# EAGLE schematic mrna_badge (EAGLE 9.7.0)
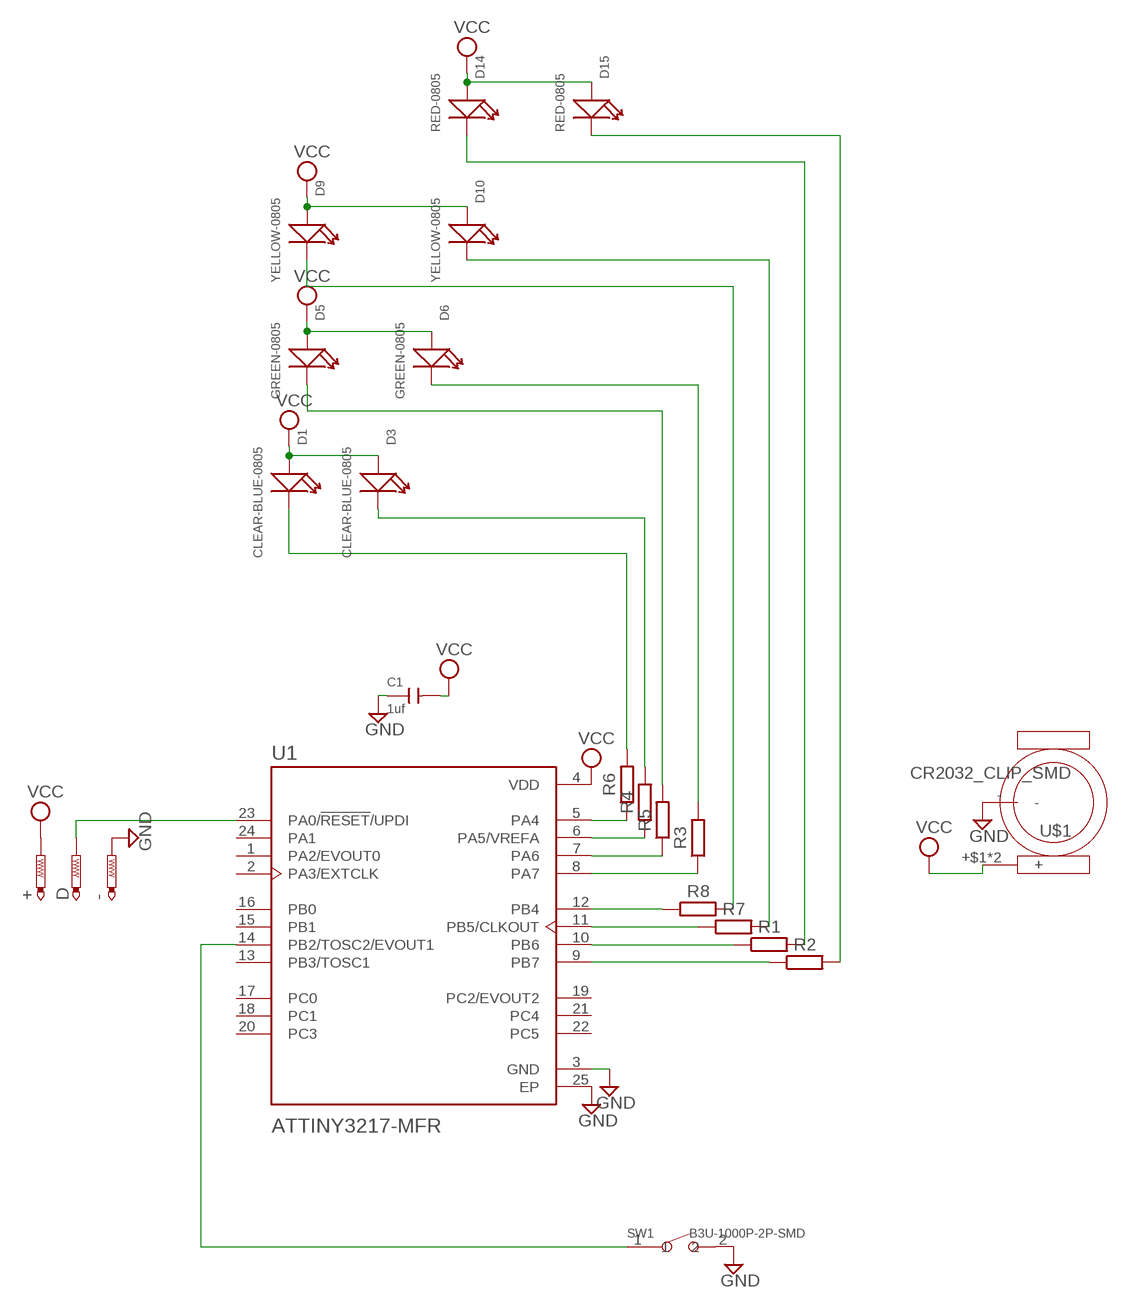
[diagram p0: schematic, sheet 1]

## Parts
+  PTR1TP15R  [TP15R]
-  PTR1TP15R  [TP15R]
C1  1uf  CERAMIC-1UF-25V-10%-X7R(0805)  [C0805]
D  PTR1TP15R  [TP15R]
D1  CLEAR-BLUE-0805  SMD-LED-CLEAR-BLUE(0805)  [LED-0805]
D3  CLEAR-BLUE-0805  SMD-LED-CLEAR-BLUE(0805)  [LED-0805]
D5  GREEN-0805  SMD-LED-CLEAR-GREEN(0805)  [LED-0805]
D6  GREEN-0805  SMD-LED-CLEAR-GREEN(0805)  [LED-0805]
D9  YELLOW-0805  SMD-LED-CLEAR-YELLOW(0805)  [LED-0805]
D10  YELLOW-0805  SMD-LED-CLEAR-YELLOW(0805)  [LED-0805]
D14  RED-0805  SMD-LED-CLEAR-RED(0805)  [LED-0805]
D15  RED-0805  SMD-LED-CLEAR-RED(0805)  [LED-0805]
R1  R_CHIP-0805(2012-METRIC)  [RESC2012X65]
R2  R_CHIP-0805(2012-METRIC)  [RESC2012X65]
R3  R_CHIP-0805(2012-METRIC)  [RESC2012X65]
R4  R_CHIP-0805(2012-METRIC)  [RESC2012X65]
R5  R_CHIP-0805(2012-METRIC)  [RESC2012X65]
R6  R_CHIP-0805(2012-METRIC)  [RESC2012X65]
R7  R_CHIP-0805(2012-METRIC)  [RESC2012X65]
R8  R_CHIP-0805(2012-METRIC)  [RESC2012X65]
SW1  B3U-1000P-2P-SMD  SMD-BUTTON(2P-3.0X2.5X1.2+0.4MM)-B3U-1000P-2P-SMD  [SW2-2.6-3.0X2.5X1.2+0.4MM]
U1  ATTINY3217-MFR  [QFN50P400X400X90-25N]
U$1  CR2032_CLIP_SMD  [CR2032_SMT_BAT-HLD-001]

## Nets
GND: -.TP C1.1 SW1.2 U1.3(GND) U1.25(EP) U$1.-
N$1: R4.1 U1.6(PA5/VREFA)
N$2: R5.1 U1.7(PA6)
N$3: D5.- R5.2
N$4: R1.1 U1.10(PB6)
N$5: R6.1 U1.5(PA4)
N$6: R2.1 U1.9(PB7)
N$7: R3.1 U1.8(PA7)
N$8: D1.- R6.2
N$9: SW1.1 U1.14(PB2/TOSC2/EVOUT1)
N$10: D.TP U1.23(PA0/!RESET!/UPDI)
N$11: R7.1 U1.11(PB5/CLKOUT)
N$12: D3.- R4.2
N$13: D6.- R3.2
N$14: D10.- R7.2
N$15: D15.- R2.2
N$16: R8.1 U1.12(PB4)
N$17: D9.- R8.2
N$18: D14.- R1.2
VCC: +.TP C1.2 D1.+ D3.+ D5.+ D6.+ D9.+ D10.+ D14.+ D15.+ U1.4(VDD) U$1.+$1(+) U$1.+$2(+)
Unconnected: U1.1(PA2/EVOUT0) U1.2(PA3/EXTCLK) U1.13(PB3/TOSC1) U1.15(PB1) U1.16(PB0) U1.17(PC0) U1.18(PC1) U1.19(PC2/EVOUT2) U1.20(PC3) U1.21(PC4) U1.22(PC5) U1.24(PA1)

## Library data of the parts
+ - D = testpad:PTR1: TEST PIN
C1 = OPL_Capacitor:CERAMIC-1UF-25V-10%-X7R(0805): 302010179; MPN: CC0805KKX7R8BB105
D1 D3 = OPL_Optoelectronics:SMD-LED-CLEAR-BLUE(0805): 304090061; MPN: EL-17-215/BHC-AN1P2/3T
D5 D6 = OPL_Optoelectronics:SMD-LED-CLEAR-GREEN(0805): 304090057; MPN: 17-215SYGC/S530-E2/TR8
D9 D10 = OPL_Optoelectronics:SMD-LED-CLEAR-YELLOW(0805): 304090039; MPN: 17-215UYC/S530-A3/TR8
D14 D15 = OPL_Optoelectronics:SMD-LED-CLEAR-RED(0805): 304090046; MPN: 17-215SURC/S530-A2/TR8
R1-R8 = Resistor:R: Resistor Fixed - Generic; CATEGORY: Resistor; SUB-CATEGORY: Fixed
SW1 = OPL_Switch_larger_pads:SMD-BUTTON(2P-3.0X2.5X1.2+0.4MM): 311020047; MPN: B3U-1000P-2P-SMD
U1 = ATTINY3217-MFR:ATTINY3217-MFR: 20MHZ, 32KB, QFN24, Ind 125C, Green, T&r; AVAILABILITY: Unavailable; DESCRIPTION: 20MHZ, 32KB, QFN24, Ind 125C, Green, T&r; MF: Microchip; MP: ATTINY3217-MFR; PACKAGE: VFQFN-24 Microchip; PRICE: None
U$1 = CR2032_CLIP:CR2032_CLIP_SMD